# EAGLE design team (EAGLE 9.2.2)
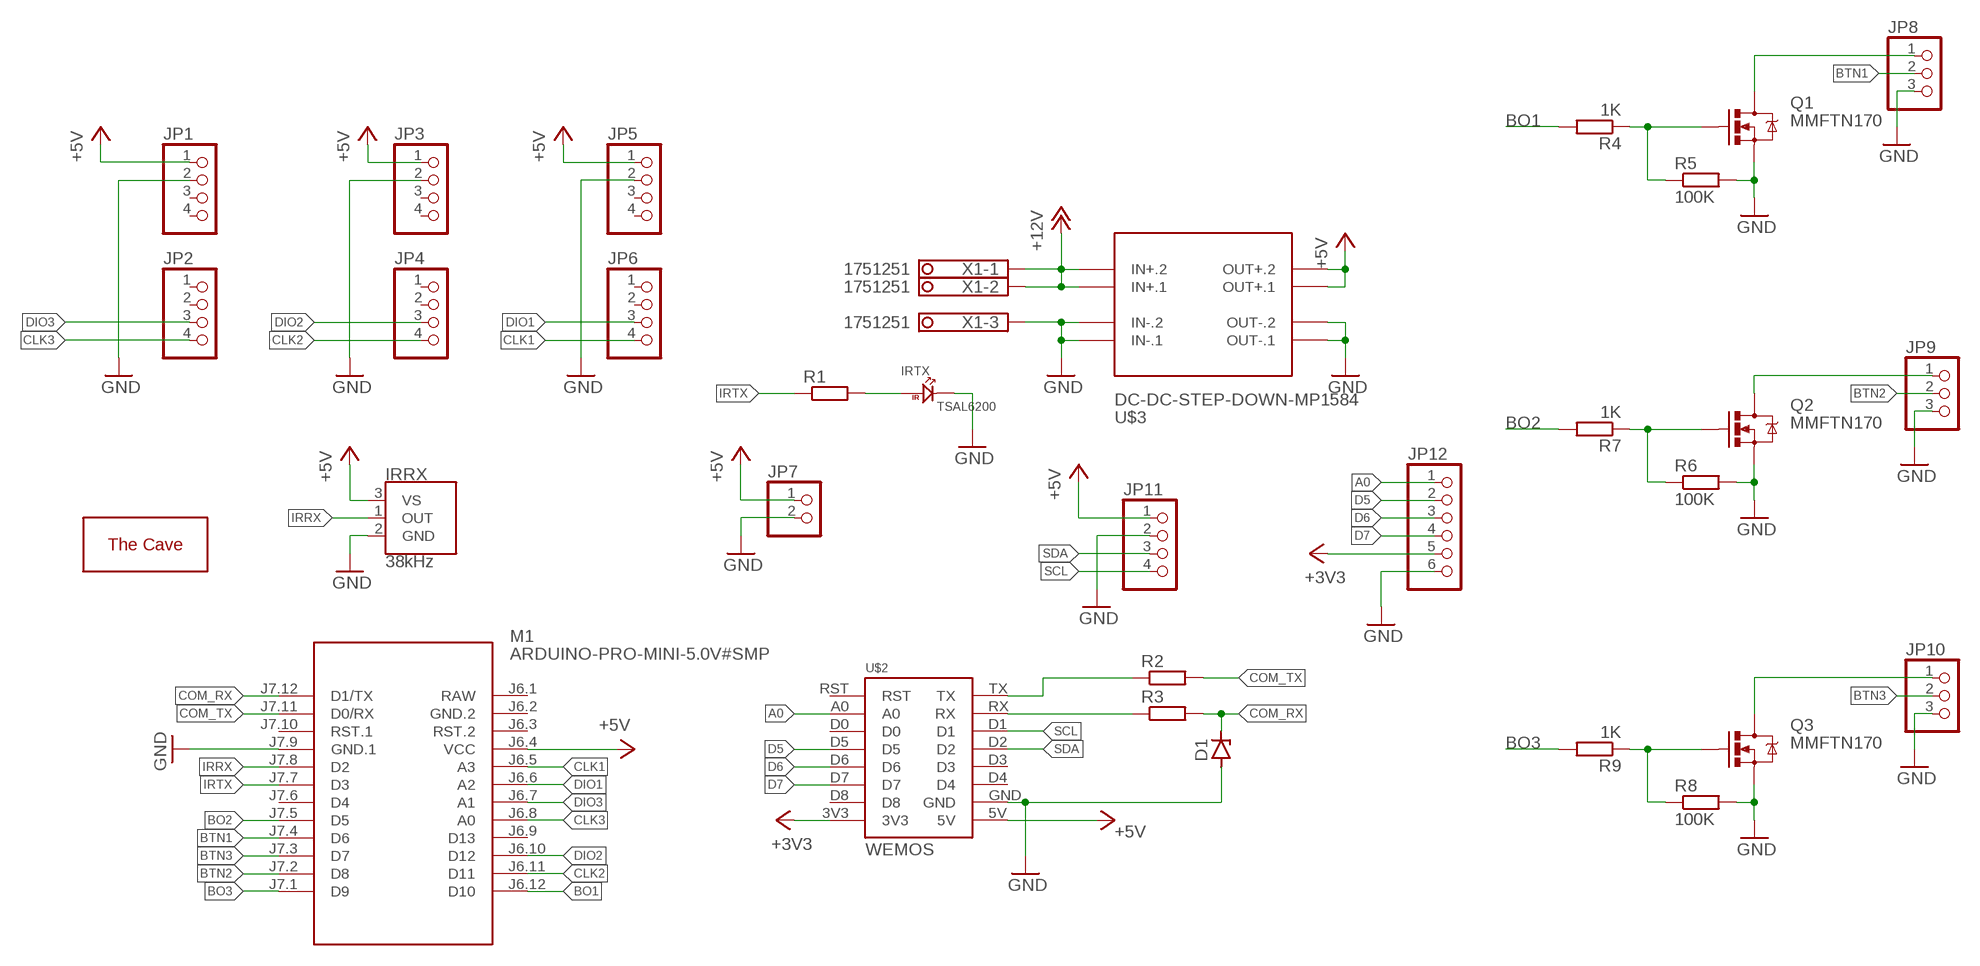
[diagram p0: schematic, sheet 1]

## Parts
D1  ZENER-DIODEDO34-7  [DO34Z7]
IRRX  38kHz  TSOP38238  [TSOP382]
IRTX  TSAL6200  [TSAL6200]
JP1  PINHD-1X4  [1X04]
JP2  PINHD-1X4  [1X04]
JP3  PINHD-1X4  [1X04]
JP4  PINHD-1X4  [1X04]
JP5  PINHD-1X4  [1X04]
JP6  PINHD-1X4  [1X04]
JP7  PINHD-1X2  [1X02]
JP8  PINHD-1X3  [1X03]
JP9  PINHD-1X3  [1X03]
JP10  PINHD-1X3  [1X03]
JP11  PINHD-1X4  [1X04]
JP12  PINHD-1X6  [1X06]
M1  ARDUINO-PRO-MINI-5.0V#SMP  [ARDUINO-PRO-MINI#SMP]
Q1  MMFTN170  MOSFET-NCHANNELAO3404A  [SOT23-3]
Q2  MMFTN170  MOSFET-NCHANNELAO3404A  [SOT23-3]
Q3  MMFTN170  MOSFET-NCHANNELAO3404A  [SOT23-3]
R1  R-EU_0207/7  [0207/7]
R2  R-EU_0207/7  [0207/7]
R3  R-EU_0207/7  [0207/7]
R4  1K  R-EU_R0805  [R0805]
R5  100K  R-EU_R0805  [R0805]
R6  100K  R-EU_R0805  [R0805]
R7  1K  R-EU_R0805  [R0805]
R8  100K  R-EU_R0805  [R0805]
R9  1K  R-EU_R0805  [R0805]
U$1  THECAVE_LOGO_NEW_TOP  [NEW_LOGO_TOP]
U$2  WEMOS  [WEMOS]
U$3  DC-DC-STEP-DOWN-MP1584  [DC-DC-STEP-DOWN-MP1584]
X1  1751251  [1751251]

## Nets
+3V3: JP12.5 U$2.3V3
+5V: IRRX.3(VS) JP1.1 JP3.1 JP5.1 JP7.1 JP11.1 M1.J6.4(VCC) U$2.5V U$3.OUT+.1 U$3.OUT+.2
+12V: U$3.IN+.1 U$3.IN+.2 X1.1 X1.2
A0: JP12.1 U$2.A0
BO1: M1.J6.12(D10) R4.2
BO2: M1.J7.5(D5) R7.2
BO3: M1.J7.1(D9) R9.2
BTN1: JP8.2 M1.J7.4(D6)
BTN2: JP9.2 M1.J7.2(D8)
BTN3: JP10.2 M1.J7.3(D7)
CLK1: JP6.4 M1.J6.5(A3)
CLK2: JP4.4 M1.J6.11(D11)
CLK3: JP2.4 M1.J6.8(A0)
COM_RX: D1.C M1.J7.12(D1/TX) R3.2
COM_TX: M1.J7.11(D0/RX) R2.2
D5: JP12.2 U$2.D5
D6: JP12.3 U$2.D6
D7: JP12.4 U$2.D7
DIO1: JP6.3 M1.J6.6(A2)
DIO2: JP4.3 M1.J6.10(D12)
DIO3: JP2.3 M1.J6.7(A1)
GND: D1.A IRRX.2(GND) IRTX.N JP1.2 JP3.2 JP5.2 JP7.2 JP8.3 JP9.3 JP10.3 JP11.2 JP12.6 M1.J7.9(GND.1) Q1.2(S) Q2.2(S) Q3.2(S) R5.2 R6.2 R8.2 U$2.GND U$3.IN-.1 U$3.IN-.2 U$3.OUT-.1 U$3.OUT-.2 X1.3
IRRX: IRRX.1(OUT) M1.J7.8(D2)
IRTX: M1.J7.7(D3) R1.1
N$1: R2.1 U$2.TX
N$2: IRTX.P R1.2
N$4: R3.1 U$2.RX
N$7: JP8.1 Q1.3(D)
N$8: Q1.1(G) R4.1 R5.1
N$9: JP9.1 Q2.3(D)
N$10: Q2.1(G) R6.1 R7.1
N$11: JP10.1 Q3.3(D)
N$12: Q3.1(G) R8.1 R9.1
SCL: JP11.4 U$2.D1
SDA: JP11.3 U$2.D2
Unconnected: JP1.3 JP1.4 JP2.1 JP2.2 JP3.3 JP3.4 JP4.1 JP4.2 JP5.3 JP5.4 JP6.1 JP6.2 M1.J6.3(RST.2) M1.J6.9(D13) M1.J7.6(D4) M1.J7.10(RST.1) U$2.D0 U$2.D3 U$2.D4 U$2.D8 U$2.RST

## Power pins joined to a net without a drawn wire
GND.2: M1.J6.2(GND.2)
RAW: M1.J6.1(RAW)

## Library data of the parts
D1 = diode:ZENER-DIODE: Z-Diode
IRRX = SparkFun-Sensors:TSOP382: Vishay Semiconductor TSOP32838 - 38kHz IR Receiver These products are miniaturized IR receiver modules for infrared remote control systems. A PIN diode and a preamplifier are assembled on a leadframe, the epoxy package contains an IR filter. The demodulated output signal can be directly connected to a microprocessor for decoding.; PROD_ID: SEN-10266
IRTX = Seeed-OPL-2017-01-Sensor-camilo:TSAL6200: 314020023
JP1-JP6 JP11 = pinhead:PINHD-1X4: PIN HEADER
JP7 = pinhead:PINHD-1X2: PIN HEADER
JP8-JP10 = pinhead:PINHD-1X3: PIN HEADER
JP12 = pinhead:PINHD-1X6: PIN HEADER
M1 = diy-modules:ARDUINO-PRO-MINI-*#SMP: Arduino Pro Mini (and compatible devices) with 2 connectors only More details available here: https://www.arduino.cc/en/Main/ArduinoBoardProMini Click here to find device on ebay.com <http://www.ebay.com/sch/arduino+pro+mini>
Q1-Q3 = SparkFun-DiscreteSemi:MOSFET-NCHANNEL: Common NMOSFET Parts MFG P/N Store ID Prod ID FDD8780 TRANS-09984 SI7820DN TRANS-11055 FDS6630A IC-08089 2N7002PW TRANS-11151 FQP30N06L COM-10213 TRANS-10060 BSS123LT1G TRANS-08345 BSS138 TRANS-00830 BS170 2N7000; PROD_ID: TRAN-12988
R1-R3 = rcl:R-EU_: RESISTOR, European symbol; SPICEPREFIX: R
R4-R9 = rcl:R-EU_: RESISTOR, European symbol
U$1 = thecave:THECAVE_LOGO: The Cave DIY workshop logos thecave.cz
U$2 = d1-mini:WEMOS
U$3 = diy-modules:DC-DC-STEP-DOWN-MP1584: DC/DC Step-Down Regulator based on MP1584 chip MP1584 datasheet available here: http://www.haoyuelectronics.com/Attachment/MP1584/MP1584.pdf Click here to find device on ebay.com <http://www.ebay.com/sch/mp1584+module>
X1 = con-phoenix-350:1751251: MKDS 1/ 3-3,5 Printklemme Nennstrom: 10 A Bemessungsspannung: 160 V Raster: 3,5 mm Polzahl: 3 Montageart: Löten Anschlussart: Schraubanschluss Anschlussrichtung vom Leiter zur Platine: 0° Source: http://eshop.phoenixcontact.com .. 1751251.pdf; OC_FARNELL: unknown; OC_NEWARK: unknown

## Board
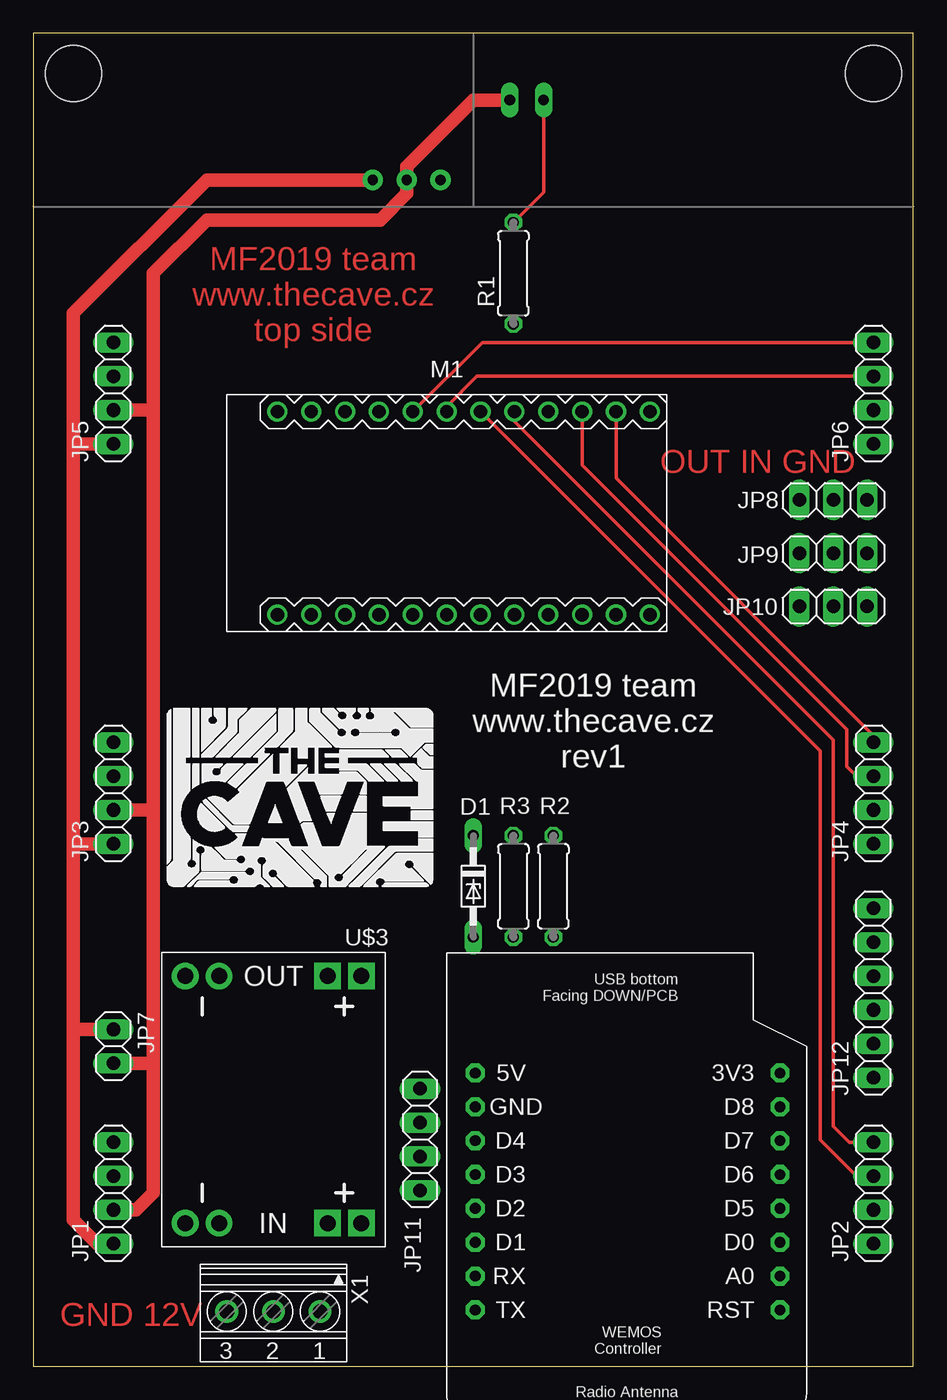
[diagram p1: board, top side]
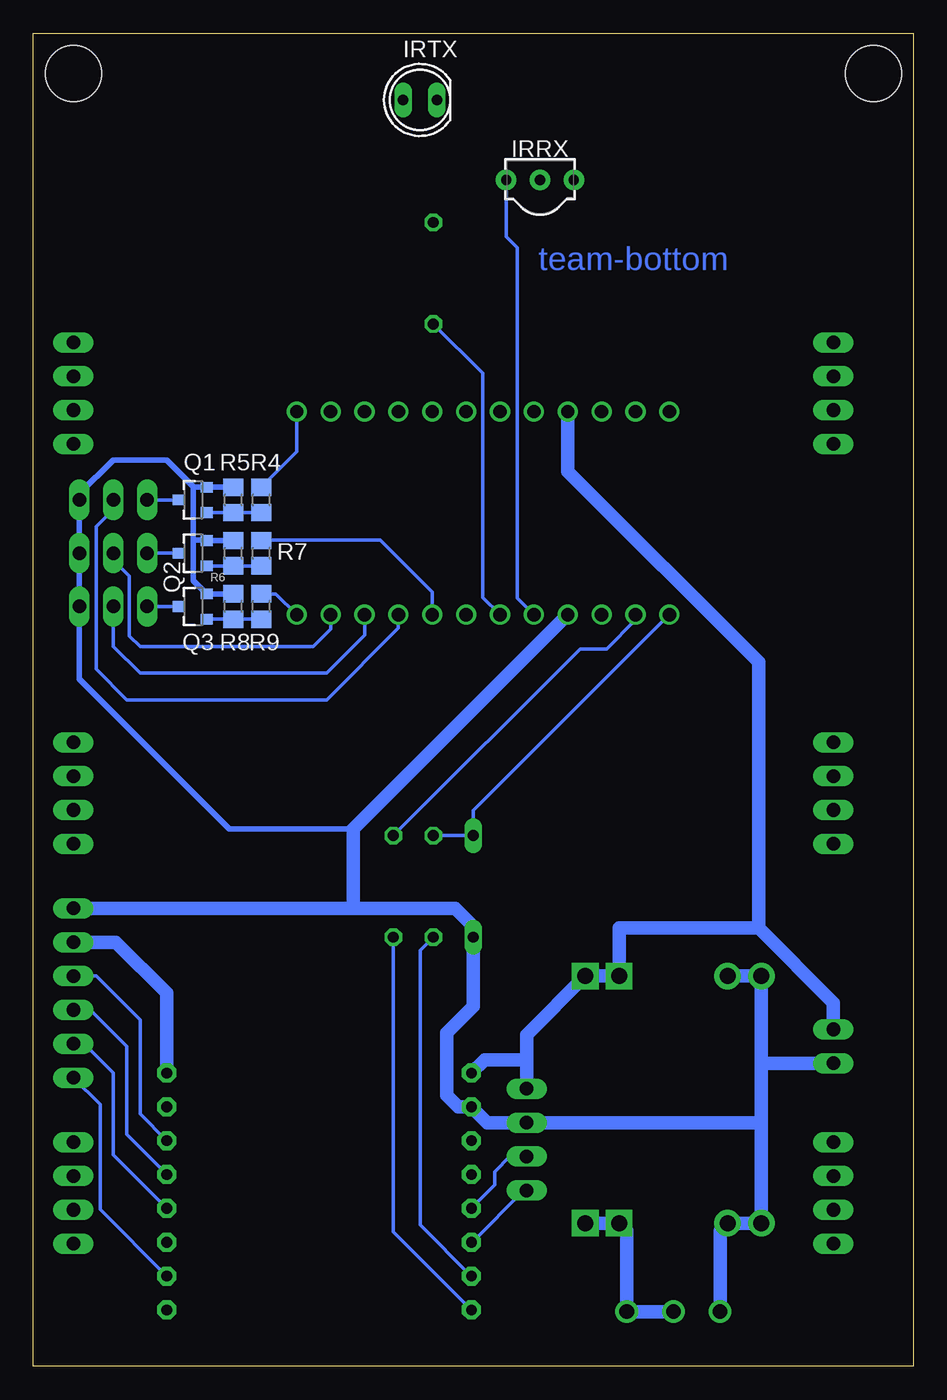
[diagram p2: board, bottom side, seen from below]

Size 66 x 100 mm. Coordinates in mm from the lower left corner, seen from the top.
Outline: 0,0 66,0 66,100 0,100 0,0
Copper layers (1*16): Top 0.035mm / dielectric 1.5mm / Bottom 0.035mm
Design rules "default": minimum track width 6mil, minimum drill 0.35mm, track to track 6mil, track to pad 6mil, pad to pad 6mil, via to via 6mil, smd to smd 6mil, copper to edge 40mil, drill to drill 6mil, minimum pad ring 10mil, minimum via ring 8mil, stop-mask expansion 4mil, vias tented up to drill 0mil, thermal gap 10mil
Holes 4.2 mm at 3,97 63,97

### Footprints (pad centres in the part's own frame; a part is rotated, then mirrored left to right if it is on the bottom)
DO34Z7 = drill 0.813 long: A 3.81,0; C -3.81,0
TSOP382 = drill 0.762 pad 1.524: 1 -2.54,0; 2 0,0; 3 2.54,0
TSAL6200 = drill 0.8 long: N 1.27,0; P -1.27,0
1X04 = drill 1.016 long: 1 -3.81,0; 2 -1.27,0; 3 1.27,0; 4 3.81,0
1X02 = drill 1.016 long: 1 -1.27,0; 2 1.27,0
1X03 = drill 1.016 long: 1 -2.54,0; 2 0,0; 3 2.54,0
1X06 = drill 1.016 long: 1 -6.35,0; 2 -3.81,0; 3 -1.27,0; 4 1.27,0; 5 3.81,0; 6 6.35,0
ARDUINO-PRO-MINI#SMP = drill 1: J6.1 -12.7,7.62; J6.2 -10.16,7.62; J6.3 -7.62,7.62; J6.4 -5.08,7.62; J6.5 -2.54,7.62; J6.6 0,7.62; J6.7 2.54,7.62; J6.8 5.08,7.62; J6.9 7.62,7.62; J6.10 10.16,7.62; J6.11 12.7,7.62; J6.12 15.24,7.62; J7.1 15.24,-7.62; J7.2 12.7,-7.62; J7.3 10.16,-7.62; J7.4 7.62,-7.62; J7.5 5.08,-7.62; J7.6 2.54,-7.62; J7.7 0,-7.62; J7.8 -2.54,-7.62; J7.9 -5.08,-7.62; J7.10 -7.62,-7.62; J7.11 -10.16,-7.62; J7.12 -12.7,-7.62
SOT23-3 = smd 0.8 x 0.9: 1 -0.95,-1; 2 0.95,-1; 3 0,1.1
0207/7 = drill 0.813 octagon: 1 -3.81,0; 2 3.81,0
R0805 = smd 1.3 x 1.5: 1 -0.95,0; 2 0.95,0
WEMOS = drill 0.8 pad 1.422 octagon: 3V3 0,0; 5V 22.86,0; A0 0,15.24; D0 0,12.7; D1 22.86,12.7; D2 22.86,10.16; D3 22.86,7.62; D4 22.86,5.08; D5 0,10.16; D6 0,7.62; D7 0,5.08; D8 0,2.54; GND 22.86,2.54; RST 0,17.78; RX 22.86,15.24; TX 22.86,17.78
DC-DC-STEP-DOWN-MP1584 = drill 1.2 pad 2 square: IN+.1 -9.271,-4.064; IN+.2 -9.271,-6.604; OUT+.1 9.271,-4.064; OUT+.2 9.271,-6.604 | drill 1.2 pad 2: IN-.1 -9.271,6.604; IN-.2 -9.271,4.064; OUT-.1 9.271,6.604; OUT-.2 9.271,4.064
1751251 = drill 1.1 pad 1.7: 1 -3.5,-0.1; 2 0,-0.1; 3 3.5,-0.1

### Placement (x,y rotation side)
D1  33,36 270 top
IRRX  28,89 0 bottom
IRTX  37,95 0 bottom
JP1  6,13 90 top
JP2  63,13 90 top
JP3  6,43 90 top
JP4  63,43 90 top
JP5  6,73 90 top
JP6  63,73 90 top
JP7  6,24 270 top
JP8  60,65 0 top
JP9  60,61 0 top
JP10  60,57 0 top
JP11  29,17 270 top
JP12  63,28 90 top
M1  31,64 0 top
Q1  54,65 90 bottom
Q2  54,61 90 bottom
Q3  54,57 90 bottom
R1  36,82 90 top
R2  39,36 90 top
R3  36,36 90 top
R4  48.9,65 90 bottom
R5  51,65 90 bottom
R6  51,61 90 bottom
R7  48.9,61 90 bottom
R8  51,57 90 bottom
R9  48.9,57 90 bottom
U$1  10,36 0 top
U$2  56,22 180 top
U$3  18,20 90 top
X1  18,4 180 top

### Tracks (layer width: path | path; a pad name or v marks a point on that pad's centre or on a via)
+3V3
  Bottom 1.016: U$2.3V3 56,28 59.81,31.81 JP12.5
+5V
  Top 0.61: 3,69 3.19,69.19
  Top 1.016: JP1.1 4.81,9.19 3,11 3,25 | 3,39.19 3,69 3,79 13,89 IRRX.3 | 3.19,69.19 JP5.1 | JP3.1 3,39.19 | 3,25 3,39.19 | JP7.1 3.27,25.27 3,25
  Bottom 1.016: M1.J6.4 25.92,67.13 11.6,52.81 11.6,32.87 | 11.6,32.87 6,27.27 JP7.1 | 11.6,32.87 22.06,32.87 U$3.OUT+.1 U$3.OUT+.2 29,24.88 29,23 | JP11.1 29,23 | U$2.5V 32.14,23 29,23
+12V
  Bottom 1.016: U$3.IN+.2 U$3.IN+.1 21.5,10.16 X1.1 X1.2
A0
  Bottom 0.254: U$2.A0 61,11.76 61,19.65 JP12.1
BO1
  Bottom 0.254: R4.2 46.24,68.61 M1.J6.12
BO2
  Bottom 0.254: R7.2 48.85,62 40,62 36.08,58.08 M1.J7.5
BO3
  Bottom 0.254: R9.2 47.81,57.95 M1.J7.1
BTN1
  Bottom 0.254: M1.J7.4 38.62,55.38 44,50 59,50 61.3,52.3 61.3,63 60.2,64.1 60.1,64.1 60,64.2 JP8.2
BTN2
  Bottom 0.254: JP9.2 60,60.5 58.8,59.3 58.8,54.8 58,54 45,54 43.7,55.3 M1.J7.2
BTN3
  Bottom 0.254: JP10.2 60,54 58,52 44,52 41.16,54.84 M1.J7.3
CLK1
  Top 0.254: JP6.4 33.65,76.81 M1.J6.5
CLK2
  Top 0.254: JP4.4 63,47.32 43.7,66.62 M1.J6.11
CLK3
  Top 0.254: JP2.4 61.19,16.81 60,18 60,47 36.08,70.92 M1.J6.8
COM_RX
  Bottom 0.254: M1.J7.12 33,41.68 D1.C R3.2
COM_TX
  Bottom 0.254: R2.2 25,53.81 23,53.81 20.84,55.97 M1.J7.11
D5
  Bottom 0.254: U$2.D5 60,15.84 60,22 62.19,24.19 JP12.2
D6
  Bottom 0.254: U$2.D6 59,17.38 59,24 61.73,26.73 JP12.3
D7
  Bottom 0.254: U$2.D7 58,18.92 58,26 61.27,29.27 JP12.4
DIO1
  Top 0.254: JP6.3 33.27,74.27 31,72 M1.J6.6
DIO2
  Top 0.254: JP4.3 61.73,44.27 61,45 61,47.78 41.16,67.62 M1.J6.10
DIO3
  Top 0.254: JP2.3 61.73,14.27 59,17 59,46.16 M1.J6.7
GND
  Top 0.61: 9,72 8.73,71.73
  Top 1.016: JP1.2 7.73,11.73 9,13 9,23 | 9,23 9,41.73 | 9,41.73 9,72 9,82 13,86 26,86 28,88 IRRX.2 28,90 33,95 IRTX.N | 8.73,71.73 JP5.2 | JP3.2 9,41.73 | JP7.2 8.73,22.73 9,23
  Bottom 0.254: Q2.2 53.05,62 | 53.95,65.95 54,66
  Bottom 0.406: R8.2 Q3.2 54,58.95 54,62 | R6.2 Q2.2 | R5.2 Q1.2 53.95,65.95 | 53.05,62 54,62 | 54,62 54,66 56,68 60,68 62.54,65.46 JP8.3 JP9.3 JP10.3 62.54,51.54 51.3,40.3 42,40.3
  Bottom 1.016: U$3.OUT-.2 U$3.OUT-.1 11.4,22.73 | JP7.2 11.4,22.73 | M1.J7.9 42,40.3 42,34.35 | X1.3 14.5,10.16 U$3.IN-.2 U$3.IN-.1 11.4,18 | 11.4,22.73 11.4,18 | 11.4,18 11.67,18.27 JP11.2 31.95,18.27 U$2.GND 34.14,19.46 35,20.32 35,25 33,27 D1.A 33,33 34.35,34.35 42,34.35 | JP12.6 42,34.35
IRRX
  Bottom 0.254: M1.J7.8 29.7,57.62 29.7,83.9 30.54,84.74 IRRX.1
IRTX
  Bottom 0.254: M1.J7.7 32.3,57.68 32.3,74.49 R1.1
N$1
  Bottom 0.254: R2.1 39,10.08 U$2.TX
N$2
  Top 0.254: R1.2 38.27,88.08 IRTX.P
N$4
  Bottom 0.254: R3.1 37,31.19 37,10.62 U$2.RX
N$7
  Bottom 0.254: JP8.1 Q1.3
N$8
  Bottom 0.254: R4.1 R5.1 Q1.1
N$9
  Bottom 0.254: JP9.1 Q2.3
N$10
  Bottom 0.254: Q2.1 R6.1 R7.1
N$11
  Bottom 0.254: JP10.1 Q3.3
N$12
  Bottom 0.254: Q3.1 R8.1 R9.1
SCL
  Bottom 0.254: U$2.D1 33.1,9.3 29.21,13.19 JP11.4
SDA
  Bottom 0.254: JP11.3 30.27,15.73 31.4,14.6 31.4,13.6 33.14,11.86 U$2.D2

### Text on the board
Top: MF2019 team / www.thecave.cz / top side | OUT IN GND | GND 12V
Bottom: team-bottom
tPlace: MF2019 team / www.thecave.cz / rev1